# Altium project power_distribution.PrjPcb
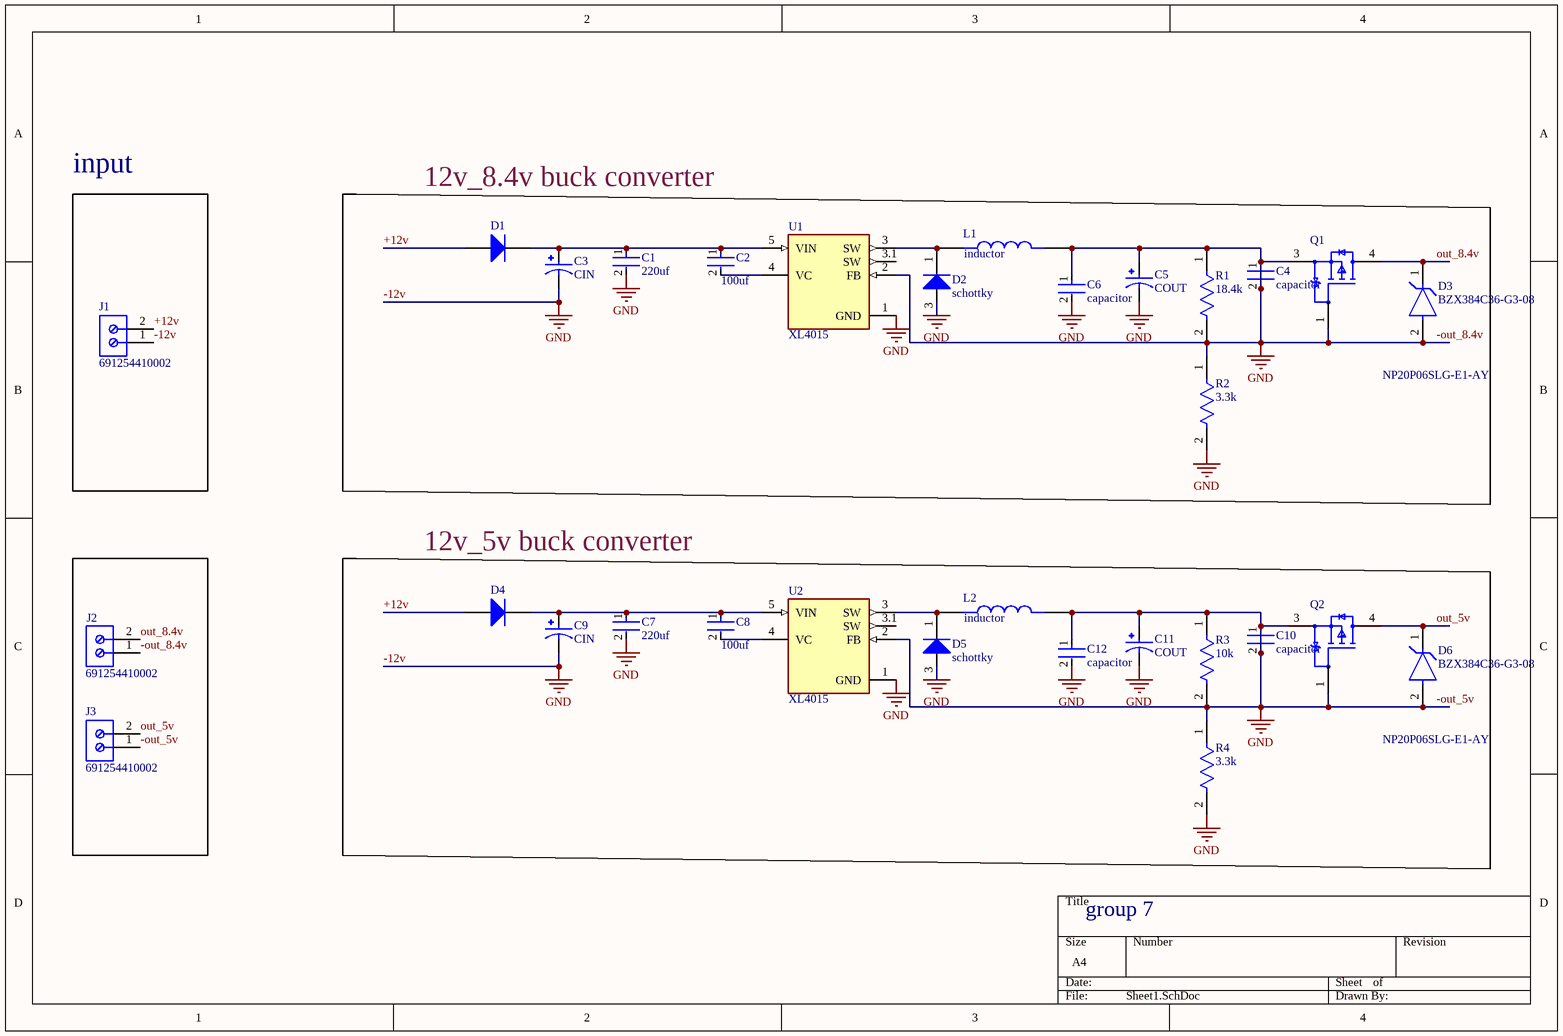
[diagram p0: Sheet1.SchDoc]
1 sheet, 31 parts. Net scope: global (net labels, ports and power ports of the same name join across sheets).
Board file: PCB1.PcbDoc

## Sheet Sheet1.SchDoc
size A4; SheetNumber: 1; SheetTotal: 1

### Parts
C1  220uf  [FP-GRM43D-0_4-IPC_A]
C2  100uf  [FP-GRM43D-0_4-IPC_A]
C3  CIN  [CAPPRD500W60D1250H1500]
C4  capacitor  [FP-GRM43D-0_4-IPC_A]
C5  COUT  [CAPPRD500W60D1250H1500]
C6  capacitor  [FP-GRM43D-0_4-IPC_A]
C7  220uf  [FP-GRM43D-0_4-IPC_A]
C8  100uf  [FP-GRM43D-0_4-IPC_A]
C9  CIN  [CAPPRD500W60D1250H1500]
C10  capacitor  [FP-GRM43D-0_4-IPC_A]
C11  COUT  [CAPPRD500W60D1250H1500]
C12  capacitor  [FP-GRM43D-0_4-IPC_A]
D1  Diode  (value not drawn)
D2  schottky  [ONSC-TO-220-2-221B-04_E]
D3  BZX384C36-G3-08  [FP-S8-V-3910_02-001-MFG]
D4  Diode  (value not drawn)
D5  schottky  [ONSC-TO-220-2-221B-04_E]
D6  BZX384C36-G3-08  [FP-S8-V-3910_02-001-MFG]
J1  691254410002  [691254410002]
J2  691254410002  [691254410002]
J3  691254410002  [691254410002]
L1  inductor  [IND_XAL6060-223MEC]
L2  inductor  [IND_XAL6060-223MEC]
Q1  NP20P06SLG-E1-AY  [DPAK230P1010X240-3_PRSS0004ZV-A_N]
Q2  NP20P06SLG-E1-AY  [DPAK230P1010X240-3_PRSS0004ZV-A_N]
R1  18.4k  [FP-RN731J-MFG]
R2  3.3k  [FP-RN73R1E-IPC_B]
R3  10k  [FP-RN731J-MFG]
R4  3.3k  [FP-RN73R1E-IPC_B]
U1  XL4015  [CONV_XL4015]
U2  XL4015  [CONV_XL4015]

### Blocks framed on the sheet
input: J1
12v_8.4v buck converter: C1-C6 D1-D3 L1 Q1 R1 R2 U1
12v_5v buck converter: C7-C12 D4-D6 L2 Q2 R3 R4 U2

### Nets
-12v: C1.2 C3.N C4.1 C4.2 C5.N C5.P C6.1 C6.2 C7.2 C9.N C10.1 C10.2 C11.N C11.P C12.1 C12.2 D2.3(A) D3.2(A) D5.3(A) D6.2(A) J1.1 J2.1 J3.1 L1.2 L2.2 Q1.1(GATE) Q1.3(SOURCE) Q2.1(GATE) Q2.3(SOURCE) R1.1 R1.2 R2.1 R2.2 R3.1 R3.2 R4.1 R4.2 U1.1(GND) U1.2(FB) U2.1(GND) U2.2(FB)  [also labelled -out_5v, -out_8.4v, GND]
+12v: D1.1(A) D4.1(A) J1.2
out_5v: D6.1(C) J3.2 Q2.4(FIN(DRAIN))
out_8.4v: D3.1(C) J2.2 Q1.4(FIN(DRAIN))
NetC1_1: C1.1 C2.1 C3.P D1.2(K) U1.5(VIN)
NetC2_2: C2.2 U1.4(VC)
NetC7_1: C7.1 C8.1 C9.P D4.2(K) U2.5(VIN)
NetC8_2: C8.2 U2.4(VC)
NetD2_1: D2.1(K) L1.1 U1.3(SW)
NetD5_1: D5.1(K) L2.1 U2.3(SW)

Not connected (* = marked no-connect by the designer): U1 3.1(SW); U2 3.1(SW)

### Notes on the sheet
- group 7

### Library data of the parts
C1 C2 C4 C6-C8 C10 C12 = CMP-06035-043619-1: Chip Multilayer Ceramic Capacitors for General Purpose, 1812, 0.10uF, X7R, 15%, 10%, 630V; Capacitance: 100nF; value: GRM43DR72J104KW01L; Depth: 3.2mm; Dielectric: X7R; Length: 4.5mm; Mount: Surface Mount; Packaging: Tape and Reel; Case/Package: 1812; Thickness: 0.087inch; Lead Free: Lead Free; Voltage Rating: 630V; REACH SVHC: No SVHC; Case Code (Metric): 4532; Termination: SMD/SMT; Case Code (Imperial): 1812; Height: 2mm; Max Operating Temperature: 125°C; Width: 3.2mm; Min Operating Temperature: -55°C; Tolerance: 10%; Number of Pins: 2; Voltage: 630V; Radiation Hardening: No; Package Quantity: 1; Voltage Rating (DC): 630V
C3 C9 = EEUFC1H221S: 220F 50V Aluminum Electrolytic Capacitors Radial, Can 5000 Hrs @ 105C; MP: EEU-FC1H221S; MF: Panasonic Electronic; SnapEDA_Link: https://www.snapeda.com/parts/EEU-FC1H221S/Panasonic+Electronic+Components/view-part/?ref=snap; Price: None; Check_prices: https://www.snapeda.com/parts/EEU-FC1H221S/Panasonic+Electronic+Components/view-part/?ref=eda; Availability: In Stock; Package: RADIAL-2 Panasonic; Purchase-URL: https://pricing.snapeda.com/search/part/EEU-FC1H221S/?ref=eda; Value: EEUFC1H221S
C5 C11 = EEUFC1H221S: 330F 25V Aluminum Electrolytic Capacitors Radial, Can 5000 Hrs @ 105C; MP: EEU-FC1H221S; MF: Panasonic Electronic; SnapEDA_Link: https://www.snapeda.com/parts/EEU-FC1H221S/Panasonic+Electronic+Components/view-part/?ref=snap; Price: None; Check_prices: https://www.snapeda.com/parts/EEU-FC1H221S/Panasonic+Electronic+Components/view-part/?ref=eda; Availability: In Stock; Package: RADIAL-2 Panasonic; Purchase-URL: https://pricing.snapeda.com/search/part/EEU-FC1H221S/?ref=eda; Value: *
D1 D4 = Diode: AF: 1; BV: 0; BV_MAX: 1e99; EG: 1.11; FC: 0.5; IBV: 0.001; ISR: 1e-14; MJSW: 0.33; NTUN: 30; TNOM: 27; XTI: 3; SimulationGenericComponent: True; CJO: 0; CJP: 0; CTA: 0; CTP: 0; FCS: 0.5; FV_MAX: 1e99; IKF: 0; IKR: 0; JSW: 0; JTUN: 0; JTUNSW: 0; KEG: 1; KF: 0; LEVEL: 1; N: 1; NBV: 1; NR: 1; NS: 1; PHP: 1; RS: 0; TCV: 0; TLEV: 0; TLEVC: 0; TM1: 0; TM2: 0; TPB: 0; TPHP: 0; TRS: 0; TRS2: 0; TT: 0; TTT1: 0; TTT2: 0; VJ: 1; XTITUN: 3; IS: 1e-14
D2 D5 = CMP-1055-00610-1: SWITCHMODE(TM) Power Rectifier, 2-Pin TO-220, Pb-Free, Tube; Manufacturer: On Semiconductor; PartNumber: MBR1045G; Configuration: Single; IFSM Max (A): 150; value: MBR1045G; RoHS: TRUE; ComponentLink2URL: http://www.onsemi.cn/pub_link/Collateral/MBR1035-D.PDF; ComponentLink1URL: http://www.onsemi.com/; ComponentLink1Description: Manufacturer URL; Packing: Tube; PackageReference: TO-220-2-221B-04_E; ComponentLink3Description: Package Specification; DatasheetVersion: Rev. 8; PackageDescription: 2-Pin Flange Mount, Vertical Straight Lead, Body 9.97 x 4.44 mm, Pitch 5.08 mm; ComponentLink3URL: http://www.onsemi.com/pub_link/Collateral/BYW29-D.PDF; ComponentLink2Description: Datasheet; PackageVersion: Rev. E; Mounting Technology: Through Hole
D3 D6 = CMP-00030-30650272-1: BZX384C36-G3-08 Zener Diode Sod3235%, 36V, 0.2W; Max Reverse Leakage Current: 50nA; Max Junction Temperature (Tj): 150°C; Voltage Tolerance: 5%; Max Power Dissipation: 200mW; Element Configuration: Single; Impedance: 90Ω; Weight: 3.997283mg; Height: 1.15mm; RoHS: Compliant; Max Operating Temperature: 150°C; Tolerance: 5%; Zener Voltage: 36V; Power Dissipation: 200mW; Mount: Surface Mount; NexarPartId: 30650272; Min Operating Temperature: -55°C; Case/Package: SOD-323-2
J1-J3 = CMP-1502-02748-2: NexarPartId: 105950827
L1 L2 = XAL6060-223MEC: 22 ÂµH Shielded Molded Inductor 5 A 60.63mOhm Max Nonstandard; MF: Coilcraft; SnapEDA_Link: https://www.snapeda.com/parts/XAL6060-223MEC/Coilcraft/view-part/?ref=snap; Package: None; Value: XAL6060-223MEC; MP: XAL6060-223MEC; Check_prices: https://www.snapeda.com/parts/XAL6060-223MEC/Coilcraft/view-part/?ref=eda
Q1 Q2 = CMP-00572-18642678-1: Mosfet, P -Ch, 60V, 20A, To-252 Rohs Compliant: Yes; Manufacturer Lifecycle Status: ACTIVE; Number of Elements: 1; Fall Time: 80ns; Continuous Drain Current (ID): -20A; Max Power Dissipation: 1.2W; Turn-Off Delay Time: 160ns; Max Junction Temperature (Tj): 175°C; Input Capacitance: 1.65nF; Drain to Source Voltage (Vdss): -60V; Rise Time: 8ns; Gate to Source Voltage (Vgs): -20V; Rds On Max: 48mΩ; ComponentLink2URL: https://octopart.com/cad-content/api/get-model-datasheet/15189/18642678; Export Control Classification Number (ECCN) Code: EAR99; China RoHS: Compliant; Radiation Hardening: No; Length: 6mm; Height: 2.4mm; Number of Pins: 3; ComponentLink3URL: https://www.renesas.com/en/document/psc/package-drawing-mp-3zk-3pin-prss0004zv; HelpURL: https://octopart.com/cad-content/api/get-model-datasheet/15189/18642678; RoHS: Compliant; Lifecycle Status: Production; ComponentLink1Description: Manufacturer's Website; ComponentLink2Description: Datasheet URL; Case/Package: TO-252; Width: 6mm; Power Dissipation: 1.2W; Mount: Surface Mount; Turn-On Delay Time: 8ns; ComponentLink1URL: http://www.renesas.com; ComponentLink3Description: Manufacturer's Package Drawing; Packaging: Tape and Reel; Min Operating Temperature: -55°C; Max Operating Temperature: 175°C
R1 R3 = CMP-03211-006130-1: Thin Film Resistors RN 0603 10KΩ 0.1% 10ppm/°C; Manufacturer: TE Connectivity; Manufacturer Part Number: RN73C1J10KB; Voltage Rating: 50V; Power Rating: 0.063W; Octopart: https://octopart.com/rn73c1j10kb-te+connectivity-47108040; RoHS: TRUE; Value: 10KΩ; Device Class L1: Passive Components; ComponentLink2URL: https://www.te.com/commerce/DocumentDelivery/DDEController?Action=showdoc&DocId=Data+Sheet%7F1773270%7FP%7Fpdf%7FEnglish%7FENG_DS_1773270_P.pdf%7F9-1614352-9; Resistance: 10KΩ; Temperature Coefficient: 10ppm/°C; Device Class L2: Resistors; Temperature Range High: +155°C; Temperature: -55°C to +155°C; Series: RN73; Height: 0.55mm; Package: RN731J; octopart_url: https://octopart.com/rn73c1j10kb-te+connectivity-47108040; ComponentLink2Description: Datasheet; Temperature Range Low: -55°C; Composition: Thin Film; Ipc Land Pattern Name: RESC15580X45; Automotive: No; Lead Free: Yes; Device Class L3: Chip SMD Resistors; Category: Res; Tolerance: 0.1%
R2 R4 = CMP-04015-026447-1: 3.3kΩ ±1% 0.063W, 1/16W Chip Resistor 0402 (1005 Metric) Moisture Resistant Thin Film; value: RN73R1ETTP3301F25
U1 U2 = XL4015: 5A 180KHz 36V Buck DC to DC Converter; MF: XLSEMI; SnapEDA_Link: https://www.snapeda.com/parts/XL4015/XLSEMI/view-part/?ref=snap; Package: None; Value: *; MP: XL4015; Check_prices: https://www.snapeda.com/parts/XL4015/XLSEMI/view-part/?ref=eda